# Altium schematic sheet SENSORS.SchDoc: =title
size A3; PageSetup: Record=PageOptions|CenterHorizontal=True|CenterVertical=True|PrintScale=1.00|XCorrection=1.00|YCorrection=1.00|PrintKind=0|BorderSize=5000000|LeftOffset=0|BottomOffset=0|Orientation=2|PaperLength=1000|PaperWidth=1000|Scale=100|PaperSource=15|PrintQuality=600|MediaType=1|DitherType=10|PaperKind=Letter|PrintScaleMode=1; DocumentNumber: 7; SheetNumber: 7; SheetTotal: 9
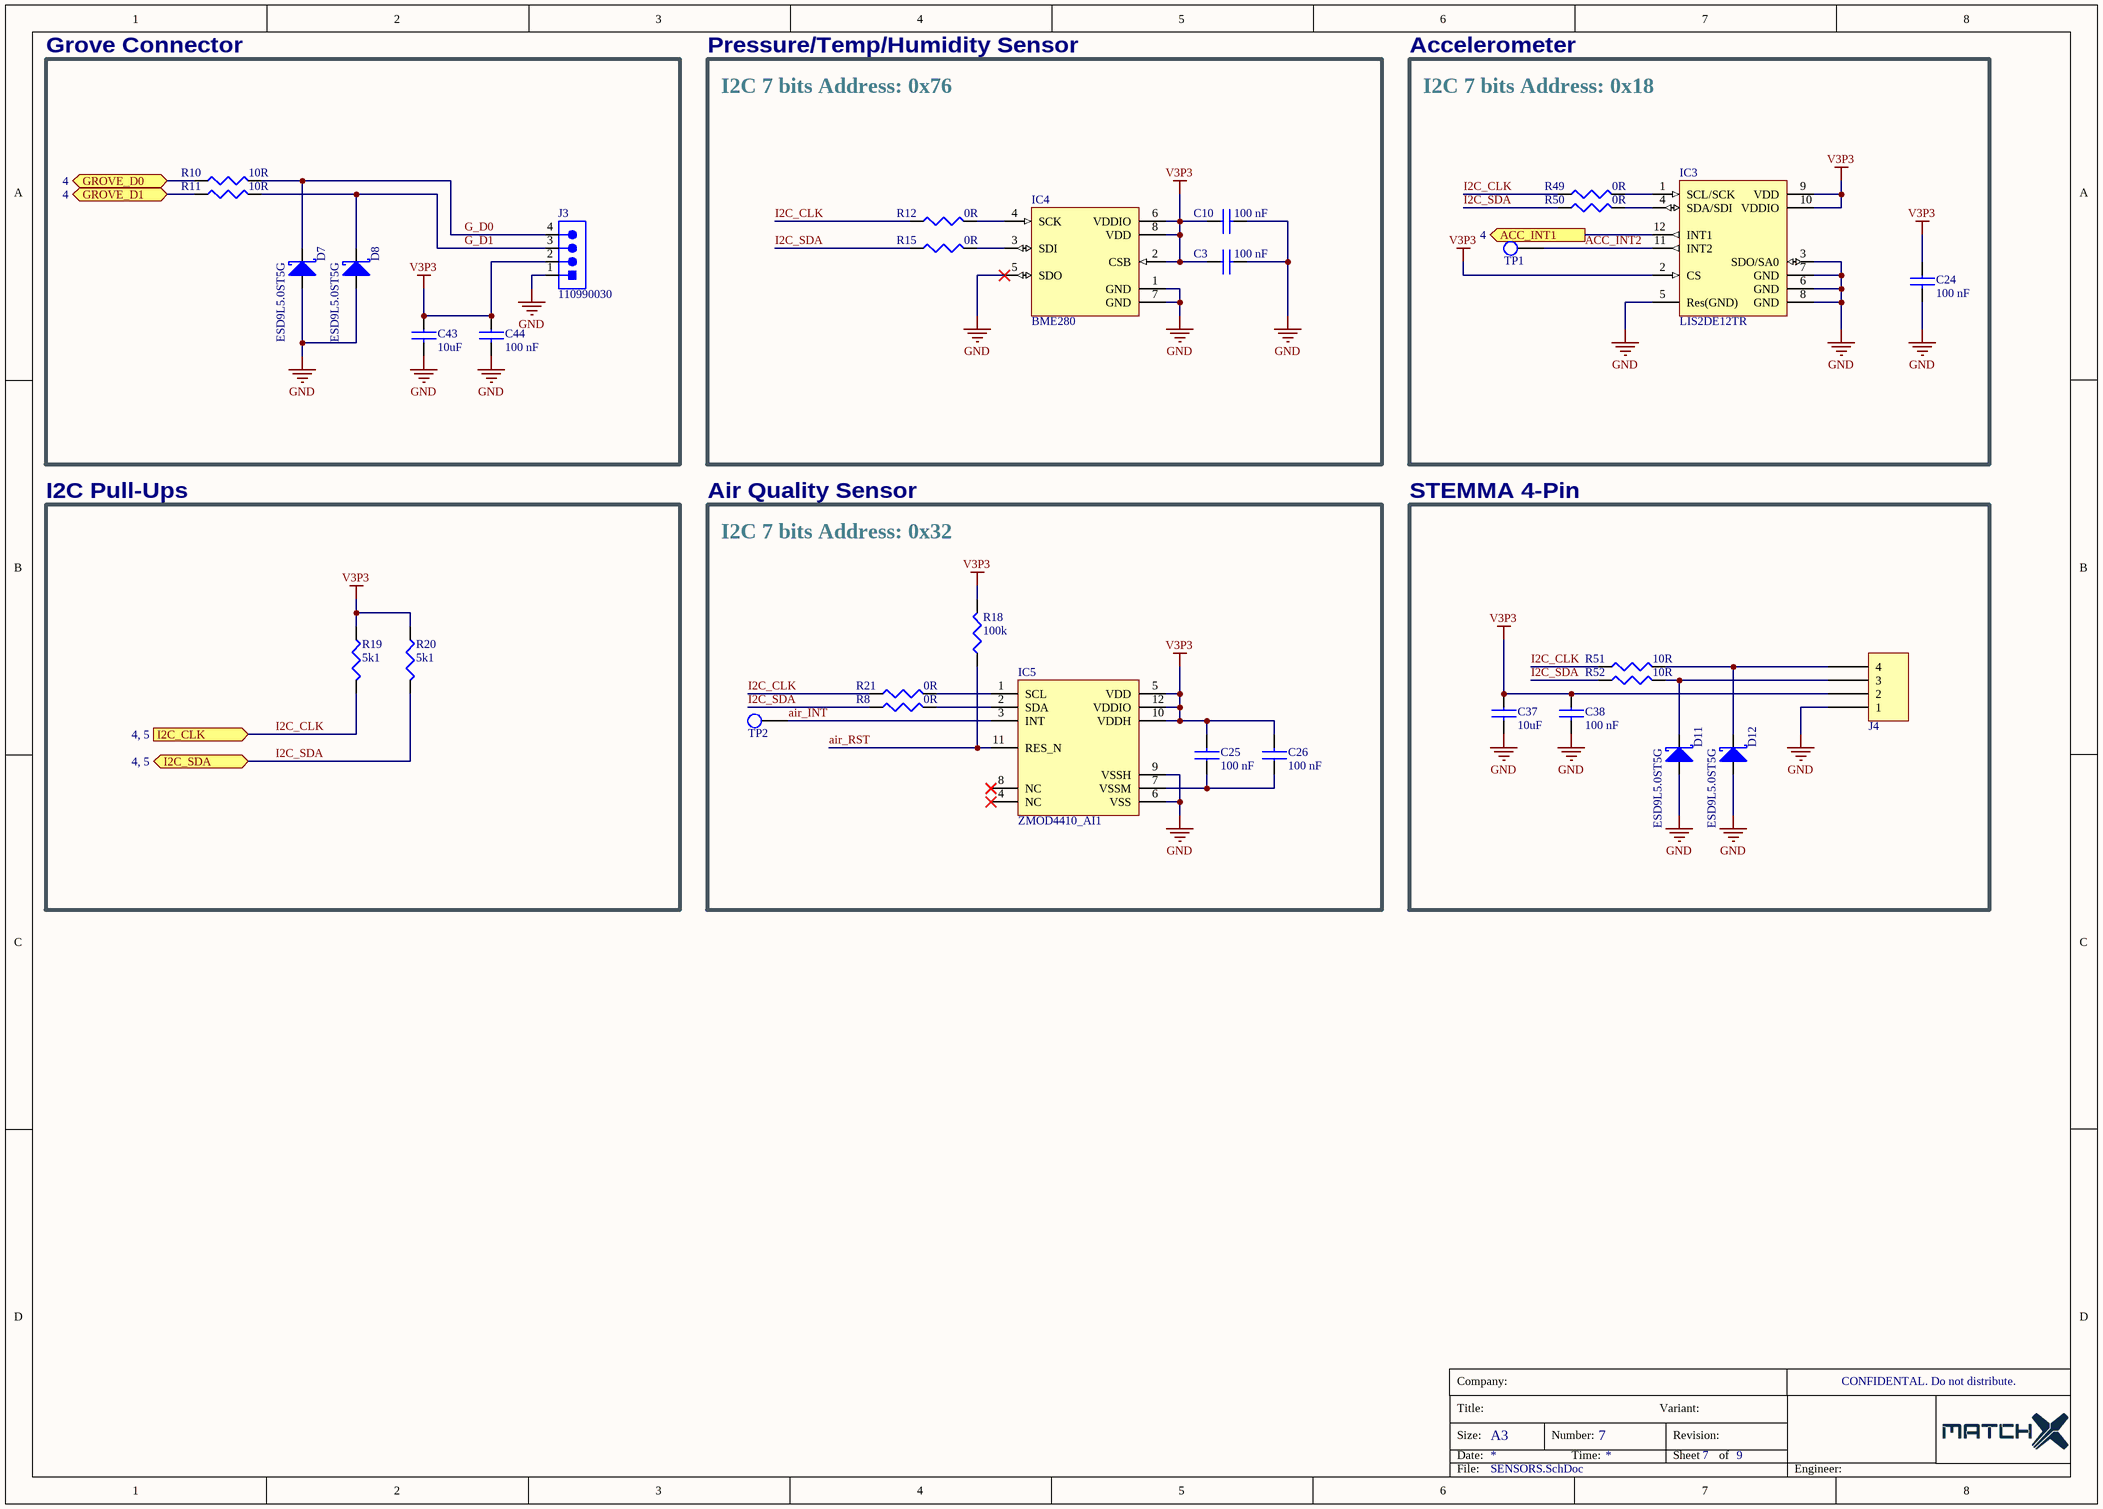
[diagram p0: SENSORS.SchDoc]

## Parts
C3  100 nF  [C0402]
C10  100 nF  [C0402]
C24  100 nF  [C0402]
C25  100 nF  [C0402]
C26  100 nF  [C0402]
C37  10uF  [C0805]
C38  100 nF  [C0402]
C43  10uF  [C0805]
C44  100 nF  [C0402]
D7  ESD9L5.0ST5G  [SOD-923]
D8  ESD9L5.0ST5G  [SOD-923]
D11  ESD9L5.0ST5G  [SOD-923]
D12  ESD9L5.0ST5G  [SOD-923]
IC3  LIS2DE12TR  [LGA12C50P4X4_200X200X100]
IC4  BME280  [LGA65P250X250-8]
IC5  ZMOD4410_AI1  [ZMOD4xxx_AI1_Standard]
J3  110990030  [CON-NS-TECH_1125S-4P]
J4  (no value)  [JST S4B-PH-SM4-TB]
R8  0R  [R0402]
R10  10R  [R0402]
R11  10R  [R0402]
R12  0R  [R0402]
R15  0R  [R0402]
R18  100k  [R0402]
R19  5k1  [R0603]
R20  5k1  [R0603]
R21  0R  [R0402]
R49  0R  [R0402]
R50  0R  [R0402]
R51  10R  [R0402]
R52  10R  [R0402]
TP1  TP  [TP_SMD_1.5mm]  (value not drawn)  (no BOM)
TP2  TP  [TP_SMD_1.5mm]  (value not drawn)  (no BOM)

## Blocks framed on the sheet
Grove Connector: C43 C44 D7 D8 J3 R10 R11
I2C Pull-Ups: R19 R20
STEMMA 4-Pin: C37 C38 D11 D12 J4 R51 R52

## Ports
ACC_INT1 (out, see 4), GROVE_D0 (bidir, see 4), GROVE_D1 (bidir, see 4), I2C_CLK (in, see 4, 5), I2C_SDA (bidir, see 4, 5)

## Nets
GND: C3.2 C10.2 C24.2 C37.2 C38.2 C43.2 C44.2 D7.2(K) D8.2(K) D11.2(K) D12.2(K) IC3.3(SDO/SA0) IC3.5(Res(GND)) IC3.6(GND) IC3.7(GND) IC3.8(GND) IC4.1(GND) IC4.5(SDO) IC4.7(GND) IC5.6(VSS) IC5.9(VSSH) J3.1 J4.1
V3P3: C3.1 C10.1 C24.1 C25.2 C26.2 C37.1 C38.1 C43.1 C44.1 IC3.2(CS) IC3.9(VDD) IC3.10(VDDIO) IC4.2(CSB) IC4.6(VDDIO) IC4.8(VDD) IC5.5(VDD) IC5.10(VDDH) IC5.12(VDDIO) J3.2 J4.2 R18.2 R19.2 R20.2
ACC_INT1: IC3.12(INT1) ; port ACC_INT1
ACC_INT2: IC3.11(INT2) TP1.0
air_INT: IC5.3(INT) TP2.0
air_RST: IC5.11(RES_N) R18.1
G_D0: D7.1(A) J3.4 R10.1
G_D1: D8.1(A) J3.3 R11.1
GROVE_D0: R10.2 ; port GROVE_D0
GROVE_D1: R11.2 ; port GROVE_D1
I2C_CLK: R12.1 R19.1 R21.1 R49.1 R51.2 ; port I2C_CLK
I2C_SDA: R8.1 R15.1 R20.1 R50.1 R52.2 ; port I2C_SDA
NetC25_1: C25.1 C26.1 IC5.7(VSSM)
NetD11_1: D11.1(A) J4.3 R52.1
NetD12_1: D12.1(A) J4.4 R51.1
NetIC3_1: IC3.1(SCL/SCK) R49.2
NetIC3_4: IC3.4(SDA/SDI) R50.2
NetIC4_3: IC4.3(SDI) R15.2
NetIC4_4: IC4.4(SCK) R12.2
NetIC5_1: IC5.1(SCL) R21.2
NetIC5_2: IC5.2(SDA) R8.2

Not connected (* = marked no-connect by the designer): IC5 4(NC)* 8(NC)*

## Notes on the sheet
- Pressure/Temp/Humidity Sensor
- I2C 7 bits Address: 0x76
- Accelerometer
- I2C 7 bits Address: 0x18
- Air Quality Sensor
- I2C 7 bits Address: 0x32
- Company:
- CONFIDENTAL. Do not distribute.
- Title:
- Size:
- Date:
- A3
- Number:
- Time:
- Variant:
- Revision:
- Sheet
- of
- File:
- Engineer:

## Library data of the parts
C3 C10 C24-C26 C38 C44 = C0402-100nF_50V: CAP, CERM, 100 nF, 50V, +/- 10%, X7R, 0402; Manufacturer Part Number: GRM155R71H104KE14J; CompType: Capacitor; Category: Capacitors; Operating Temperature: -55°C ~ 125°C; Package / Case: 0402; RoHS: RoHS Compliant; Temperature Coefficient: X7R; Tolerance: 10%; Voltage - Rated: 50 V; MountType: SMT; Technology: Ceramic; Value: 100 nF
C37 C43 = C0805-10uF_16V: CAP, CERM, 10uF, 16V, +/- 20%, X5R, 0805; Manufacturer Part Number: GRM21BR61C106KE15L; CompType: Capacitor; Value: 10uF; Category: Capacitors; Operating Temperature: -55°C ~ 85°C; Package / Case: 0805 (2012 Metric); RoHS: RoHS Compliant; Temperature Coefficient: X5R; Tolerance: 20%; Voltage - Rated: 16 V; MountType: SMT; Technology: Ceramic
D7 D8 D11 D12 = TVSUni_ESD9L5.0ST5G: TVS DIODE 5V 9.8V SOD923; Manufacturer: ON Semiconductor; Capacitance: 0.9pF; Direction: Unidirectional; Number of Unidirectional Channels: 1; Min Breakdown Voltage: 5.4V; Power Line Protection: No; Leakage Current: 1uA; Element Configuration: Single; Peak Pulse Current: 1A; Reverse Breakdown Voltage: 5.8V; Peak Pulse Power: 150mW; ESD Protection: Yes; Test Current: 1mA; Supplier 1: Digi-Key; Supplier Part Number 1: ESD9L5.0ST5GOSCT-ND; Manufacturer Part Number: ESD9L5.0ST5G; Stock 1: 56991; Pricing 1: 1=0,36000, 10=0,29700, 100=0,15730, 500=0,10350, 1000=0,07038 (USD); RoHS: Yes; Case/Package: SOD-923-2; Number of Pins: 2; Contact Plating: Tin,Matte; Min Operating Temperature: -55°C; Max Operating Temperature: 150°C; Package Quantity: 1; Packaging: Tape and Reel; Clamping Voltage: 9.8V; Reverse Standoff Voltage: 5V; Working Voltage: 5V; Composition: Zener; Number of Elements: 1; Operating Supply Voltage: 5V; Max Surge Current: 1A; Breakdown Voltage: 5.4V; Number of Channels: 1; Polarity: Unidirectional; Termination: SMD/SMT; Max Reverse Leakage Current: 1uA; Max Breakdown Voltage: 5.4V; Number of Lines: 1; Power Dissipation: 150mW; Length: 0.8mm; Height: 0.4mm; Depth: 0.6mm; Width: 0.65mm; Radiation Hardening: No; Lead Free: Lead Free; REACH SVHC: No SVHC; Halogen Free: Halogen Free; ComponentLink1URL: https://datasheet.ciiva.com/15143/getdatasheetpartid-185186-15143896.pdf?src-supplier=Verical; ComponentLink1Description: https://datasheet.ciiva.com/15143/getdatasheetpartid-185186-15143896.pdf?src-supplier=Verical; ComponentLink2URL: https://datasheet.ciiva.com/4510/esd9l-d-4510647.pdf?src-supplier=Mouser; ComponentLink2Description: https://datasheet.ciiva.com/4510/esd9l-d-4510647.pdf?src-supplier=Mouser; ComponentLink3URL: https://datasheet.ciiva.com/3304/esd9l-d-3304011.pdf?src-supplier=Avnet; ComponentLink3Description: https://datasheet.ciiva.com/3304/esd9l-d-3304011.pdf?src-supplier=Avnet; ComponentLink4URL: https://datasheet.ciiva.com/16437/esd9l-d-16437835.pdf?src-supplier=Future+Electronics; ComponentLink4Description: https://datasheet.ciiva.com/16437/esd9l-d-16437835.pdf?src-supplier=Future+Electronics; ComponentLink5URL: https://datasheet.ciiva.com/339/esd9l-d-339853.pdf?src-supplier=Digi-Key; ComponentLink5Description: https://datasheet.ciiva.com/339/esd9l-d-339853.pdf?src-supplier=Digi-Key; ComponentLink6URL: https://datasheet.ciiva.com/339/esd9l-d-339854.pdf?src-supplier=Digi-Key; ComponentLink6Description: https://datasheet.ciiva.com/339/esd9l-d-339854.pdf?src-supplier=Digi-Key; ComponentLink7URL: https://datasheet.ciiva.com/11195/esd9l-d-11195342.pdf?src-supplier=Avnet; ComponentLink7Description: https://datasheet.ciiva.com/11195/esd9l-d-11195342.pdf?src-supplier=Avnet; ComponentLink8URL: https://datasheet.ciiva.com/25958/esd9l-d-25958446.pdf?src-supplier=Avnet+Europe; ComponentLink8Description: https://datasheet.ciiva.com/25958/esd9l-d-25958446.pdf?src-supplier=Avnet+Europe; ComponentLink9URL: https://datasheet.ciiva.com/339/esd9l-d-339855.pdf?src-supplier=Digi-Key; ComponentLink9Description: https://datasheet.ciiva.com/339/esd9l-d-339855.pdf?src-supplier=Digi-Key
IC3 = ST=LIS2DE12: Accelerometer X, Y, Z Axis ±2g, 4g, 8g, 16g 0.5Hz ~ 2.69kHz 12-LGA (2x2); Manufacturer: STMicroelectronics; Output Type: SPI,I2C,Digital; Axis: X, Y, Z; Min Supply Voltage: 1.7V; Max Supply Voltage: 3.6V; .Checked PCB: OK M; Supplier 1: LCSC; Supplier Part Number 1: C155639; Manufacturer Part Number: LIS2DE12TR; Stock 1: 3611; Pricing 1: 1=1,45000, 10=1,29800, 25=1,23200, 100=1,01200, 500=0,83600, 1000=0,66000 (USD); RoHS: Yes; Mount: Surface Mount; Case/Package: LGA; Number of Pins: 12; Min Operating Temperature: -40°C; Max Operating Temperature: 85°C; Packaging: Cut Tape; Bandwidth: 0.5Hz; ComponentLink1URL: http://www.farnell.com/datasheets/2028147.pdf?src-supplier=Farnell; ComponentLink1Description: http://www.farnell.com/datasheets/2028147.pdf?src-supplier=Farnell; ComponentLink2URL: https://www.mouser.com/ds/2/389/lis2de12-954977.pdf?src-supplier=Mouser; ComponentLink2Description: https://www.mouser.com/ds/2/389/lis2de12-954977.pdf?src-supplier=Mouser; ComponentLink3URL: http://www.st.com/content/ccc/resource/technical/document/datasheet/group0/72/cb/80/a7/5e/fe/46/9d/DM00153214/files/DM00153214.pdf/jcr:content/translations/en.DM00153214.pdf?src-supplier=Digi-Key; ComponentLink3Description: http://www.st.com/content/ccc/resource/technical/document/datasheet/group0/72/cb/80/a7/5e/fe/46/9d/DM00153214/files/DM00153214.pdf/jcr:content/translations/en.DM00153214.pdf?src-supplier=Digi-Key; ComponentLink4URL: http://www.st.com/st-web-ui/static/active/en/resource/technical/document/datasheet/DM00153214.pdf?src-supplier=Avnet; ComponentLink4Description: http://www.st.com/st-web-ui/static/active/en/resource/technical/document/datasheet/DM00153214.pdf?src-supplier=Avnet; ComponentLink5URL: http://www.farnell.com/datasheets/2028147.pdf?src-supplier=Element14; ComponentLink5Description: http://www.farnell.com/datasheets/2028147.pdf?src-supplier=Element14; ComponentLink6URL: http://www.st.com/st-web-ui/static/active/en/resource/technical/document/datasheet/DM00153214.pdf?src-supplier=Avnet+Asia; ComponentLink6Description: http://www.st.com/st-web-ui/static/active/en/resource/technical/document/datasheet/DM00153214.pdf?src-supplier=Avnet+Asia; Contact Plating: Gold; REACH SVHC: No SVHC; Lead Free: Lead Free; .Checked SCH: OK M
IC4 = BOSH=BME280: SENSOR PRESSURE HUMIDITY TEMP; Manufacturer: Bosch; Sensor Type: Temperature; Output Type: SPI,I2C; Accuracy: 3%; Response Time: 1s; Supplier 1: Arrow Electronics; Supplier Part Number 1: BME280; Manufacturer Part Number: BME280; RoHS: No; Category: Temperature and Humidity Sensors; Stock 1: 6372; Pricing 1: 1=4,307900, 10=4,265400, 25=4,222800, 50=4,180300, 100=4,126200, 250=4,084800, 500=3,869800, 1000=3,655900, 3000=3,440800, 6000=3,226900 (USD); Mount: Surface Mount; Case/Package: LGA; Number of Pins: 8; Min Operating Temperature: -40°C; Max Operating Temperature: 85°C; Packaging: Cut Tape; Lead Free: Lead Free; ComponentLink1URL: https://ae-bst.resource.bosch.com/media/_tech/media/datasheets/BST-BME280-DS002.pdf?src-supplier=Digi-Key; ComponentLink1Description: https://ae-bst.resource.bosch.com/media/_tech/media/datasheets/BST-BME280-DS002.pdf?src-supplier=Digi-Key; ComponentLink2URL: https://ae-bst.resource.bosch.com/media/_tech/media/product_flyer/BME280_Productflyer_BST_20170109.pdf?src-supplier=Mouser; ComponentLink2Description: https://ae-bst.resource.bosch.com/media/_tech/media/product_flyer/BME280_Productflyer_BST_20170109.pdf?src-supplier=Mouser; ComponentLink3URL: https://ae-bst.resource.bosch.com/media/_tech/media/product_flyer/BME280_Productflyer_BST_20170109.pdf?src-supplier=Arrow+Electronics; ComponentLink3Description: https://ae-bst.resource.bosch.com/media/_tech/media/product_flyer/BME280_Productflyer_BST_20170109.pdf?src-supplier=Arrow+Electronics; ComponentLink4URL: https://ae-bst.resource.bosch.com/media/_tech/media/product_flyer/BME280_Productflyer_BST_20170109.pdf?src-supplier=NAC+Semi; ComponentLink4Description: https://ae-bst.resource.bosch.com/media/_tech/media/product_flyer/BME280_Productflyer_BST_20170109.pdf?src-supplier=NAC+Semi
IC5 = Renesas=ZMOD4410_AI1: Indoor Air Quality Sensor; Manufacturer: Renesas; Manufacturer Part Number: ZMOD4410_AI1
J3 = CON_SeedStudio_110990030: 4 Positions Header Connector 0.079" (2.00mm) Through Hole Tin; Manufacturer: Seeed Studio; Supplier 1: Digi-Key; Supplier Part Number 1: 1597-1082-ND; Manufacturer Part Number: 110990030; Stock 1: 0; ComponentLink1URL: http://www.mouser.com/ds/2/744/Seeed_316010005-786598.pdf; ComponentLink1Description: http://www.mouser.com/ds/2/744/Seeed_316010005-786598.pdf; ComponentLink2URL: http://www.seeedstudio.com/document/pdf/Preface.pdf; ComponentLink2Description: http://www.seeedstudio.com/document/pdf/Preface.pdf
J4 = CON-JST S4B-PH-SM4-TB: CONN HEADER SMD R/A 4POS 2MM; Manufacturer Part Number: 1734827-4; Manufacturer: JST Sales America Inc.; Contact Length - Mating: 0.130" (3.30mm); Current Rating (Amps): 2A; Material Flammability Rating: UL94 V-0; Number of Positions: 4; Number of Positions Loaded: All; Pitch - Mating: 0.079" (2.00mm); Shrouding: Shrouded - 4 Wall; Style: Board to Cable/Wire; Voltage Rating: 100V; ComponentLink1Description: Datasheet; ComponentLink1URL: http://www.jst-mfg.com/product/pdf/eng/ePH.pdf; ComponentLink2Description: DigiKey Link; ComponentLink2URL: http://digikey.com/product-detail/en/jst-sales-america-inc/S4B-PH-SM4-TB-LF-SN/455-1751-1-ND/926848; Connector Type: Header; Contact Finish - Mating: Tin; Contact Finish - Post: Tin; Contact Material: Copper Alloy; Contact Shape: Square; Contact Type: Male Pin; Fastening Type: Detent Lock; Features: Solder Retention; Insulation Color: Natural; Insulation Height: 0.217" (5.51mm); Insulation Material: Polyamide (PA6T), Nylon 6T; LastUpdated: 15/01/2020 03:45:33; Lifecycle Status: Active; Minimum Order: 1; Mounting Type: Surface Mount, Right Angle; Number of Rows: 1; Operating Temperature: -25°C ~ 85°C; Packaging: TapeAndReel; PartId: 117; Part Status: Active; Price: 0.37; Series: PH; Supplier 1: DigiKey; Supplier Part Number 1: 455-1751-1-ND; Termination: Solder
R8 R12 R15 R21 R49 R50 = R0402-0R: RES, 0R, 1%, 1/16 W, 0402; Manufacturer Part Number: AC0402FR-070RL; Power (Watts): 0.063W, 1/16W; .Checked PCB: OK RF; .Checked SCH: RF; Category: Resistors; Package / Case: 0402; Tolerance: ±1%; Value: 0R; RoHS: RoHS Compliant; Composition: Thick Film; Features: -; Size / Dimension: 0.039" L x 0.020" W (1.00mm x 0.50mm); Height: 0.016" (0.40mm); Number of Terminations: 2
R10 R11 R51 R52 = R0402-10R: RES, 10R, 1%, 1/16 W, 0402; Manufacturer Part Number: RC0402FR-0710RP; Power (Watts): 0.063W, 1/16W; .Checked PCB: OK RF; .Checked SCH: RF; Category: Resistors; Package / Case: 0402; Tolerance: ±1%; Value: 10R; RoHS: RoHS Compliant; Composition: Thick Film; Features: -; Size / Dimension: 0.039" L x 0.020" W (1.00mm x 0.50mm); Height: 0.016" (0.40mm); Number of Terminations: 2
R18 = R0402-100k: RES, 100k, 1%, 1/16 W, 0402; Manufacturer Part Number: AC0402FR-13100KL; Power (Watts): 0.063W, 1/16W; .Checked PCB: OK RF; .Checked SCH: RF; Category: Resistors; Package / Case: 0402; Tolerance: ±1%; Value: 100k; RoHS: RoHS Compliant; Composition: Thick Film; Features: -; Size / Dimension: 0.039" L x 0.020" W (1.00mm x 0.50mm); Height: 0.016" (0.40mm); Number of Terminations: 2
R19 R20 = R0603-5k1: RES, 5k1, 1%, 0.063 W, 0603; Manufacturer Part Number: AC0603FR-135K1L; Power (Watts): 0.063W, 1/16W; .Checked PCB: OK RF; .Checked SCH: RF; Category: Resistors; Package / Case: 0603 [1608 Metric]; Tolerance: ±1%; Value: 5k1; RoHS: RoHS Compliant; Composition: Thick Film; Features: -; Size / Dimension: 0.063" L x 0.031" W (1.60mm x 0.80mm); Height: 0.016" (0.40mm); Number of Terminations: 2
TP1 TP2 = TP: Test Point